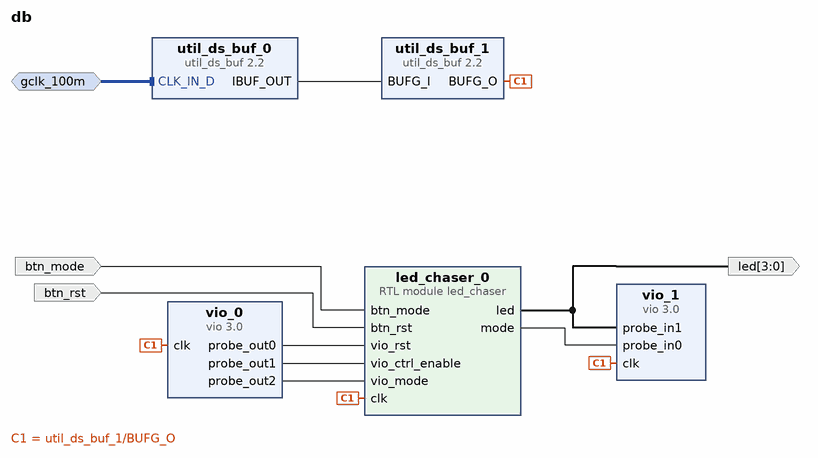
[diagram p0: block diagram of the top level]
# Vivado block design db, xcvu13p-fhgb2104-2-e, Vivado 2024.2_AR37126
create_bd_design db

create_bd_intf_port -mode Slave -vlnv xilinx.com:interface:diff_clock_rtl:1.0 gclk_100m
create_bd_port -dir I -type rst btn_rst
create_bd_port -dir I btn_mode
create_bd_port -dir O -from 3 -to 0 led

create_bd_cell -type ip -vlnv xilinx.com:ip:util_ds_buf:2.2 util_ds_buf_0
create_bd_cell -type ip -vlnv xilinx.com:ip:util_ds_buf:2.2 util_ds_buf_1
set_property -dict {CONFIG.C_BUF_TYPE BUFG} [get_bd_cells util_ds_buf_1]
create_bd_cell -type ip -vlnv xilinx.com:ip:vio:3.0 vio_0
set_property -dict [list \
  CONFIG.C_NUM_PROBE_IN 0 \
  CONFIG.C_NUM_PROBE_OUT 3 \
  CONFIG.C_PROBE_IN0_WIDTH 3 \
  CONFIG.C_PROBE_IN1_WIDTH 8 \
  CONFIG.C_PROBE_OUT0_INIT_VAL 0x1 \
  CONFIG.C_PROBE_OUT0_WIDTH 1 \
  CONFIG.C_PROBE_OUT1_WIDTH 1 \
  CONFIG.C_PROBE_OUT2_WIDTH 2 \
] [get_bd_cells vio_0]
create_bd_cell -type module -reference led_chaser led_chaser_0
create_bd_cell -type ip -vlnv xilinx.com:ip:vio:3.0 vio_1
set_property -dict [list \
  CONFIG.C_EN_PROBE_IN_ACTIVITY 0 \
  CONFIG.C_NUM_PROBE_IN 2 \
  CONFIG.C_NUM_PROBE_OUT 0 \
  CONFIG.C_PROBE_IN0_WIDTH 2 \
  CONFIG.C_PROBE_IN1_WIDTH 4 \
  CONFIG.C_PROBE_IN2_WIDTH 12 \
  CONFIG.C_PROBE_OUT0_INIT_VAL 0x1 \
  CONFIG.C_PROBE_OUT0_WIDTH 1 \
  CONFIG.C_PROBE_OUT1_WIDTH 1 \
  CONFIG.C_PROBE_OUT2_WIDTH 3 \
] [get_bd_cells vio_1]

# ---- connections ----

connect_bd_intf_net [get_bd_intf_pins util_ds_buf_0/CLK_IN_D] [get_bd_intf_ports gclk_100m]
connect_bd_net [get_bd_ports btn_mode] [get_bd_pins led_chaser_0/btn_mode]
connect_bd_net [get_bd_ports btn_rst] [get_bd_pins led_chaser_0/btn_rst]
connect_bd_net [get_bd_pins led_chaser_0/led] [get_bd_ports led] [get_bd_pins vio_1/probe_in1]
connect_bd_net [get_bd_pins led_chaser_0/mode] [get_bd_pins vio_1/probe_in0]
connect_bd_net [get_bd_pins util_ds_buf_0/IBUF_OUT] [get_bd_pins util_ds_buf_1/BUFG_I]
connect_bd_net [get_bd_pins util_ds_buf_1/BUFG_O] [get_bd_pins vio_0/clk] [get_bd_pins vio_1/clk] [get_bd_pins led_chaser_0/clk]
connect_bd_net [get_bd_pins vio_0/probe_out0] [get_bd_pins led_chaser_0/vio_rst]
connect_bd_net [get_bd_pins vio_0/probe_out1] [get_bd_pins led_chaser_0/vio_ctrl_enable]
connect_bd_net [get_bd_pins vio_0/probe_out2] [get_bd_pins led_chaser_0/vio_mode]

validate_bd_design
save_bd_design
